# EAGLE design Wireless Temp Sensor Board v1 (EAGLE 6.3)
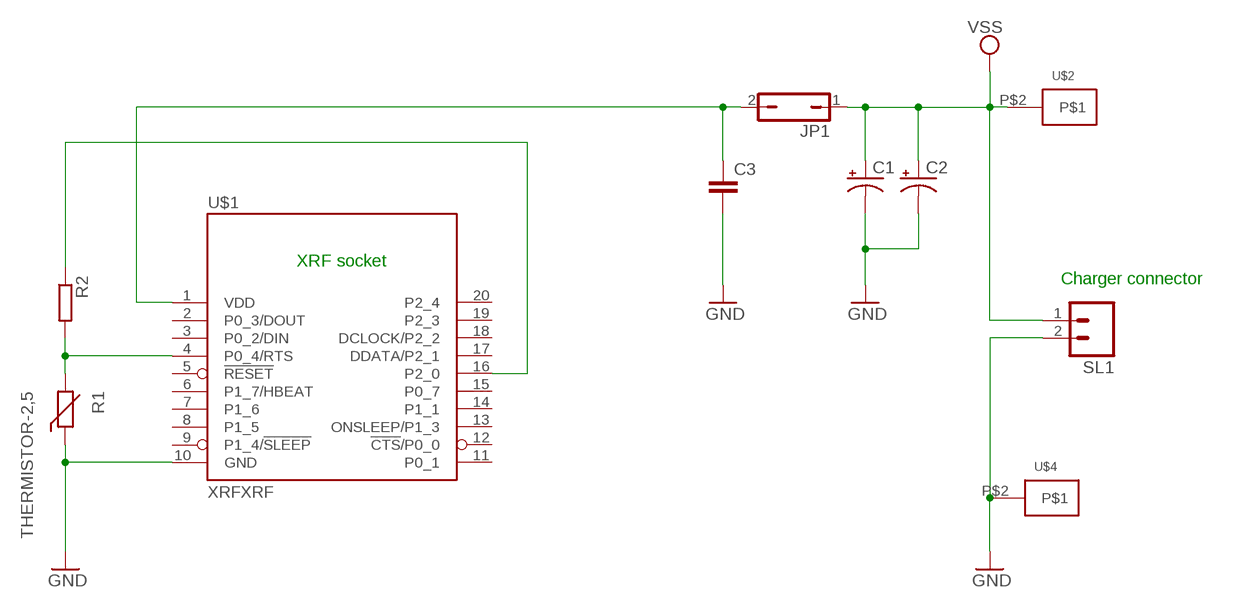
[diagram p0: schematic, sheet 1]

## Parts
C1  CPOL-USE5-10.5  [E5-10,5]
C2  CPOL-USE3.5-8  [E3,5-8]
C3  C-EU025-025X050  [C025-025X050]
JP1  JP1Q  [JP1]
R1  THERMISTOR-2,5  [RS-2,5]
R2  R-EU_0207/12  [0207/12]
SL1  M02  [02P]
U$1  XRFXRF  [XRF]
U$2  HORSESHOEDPAD  [HORSESHOEPAD]
U$4  HORSESHOEDPAD  [HORSESHOEPAD]

## Nets
GND: C1.- C2.- C3.2 R1.1 SL1.2 U$1.10(GND) U$4.P$2
N$1: R2.1 U$1.16(P2_0)
N$3: R1.2 R2.2 U$1.4(P0_4/RTS)
N$5: C3.1 JP1.2 U$1.1(VDD)
VSS: C1.+ C2.+ JP1.1 SL1.1 U$2.P$2
Unconnected: U$1.2(P0_3/DOUT) U$1.3(P0_2/DIN) U$1.5(!RESET) U$1.6(P1_7/HBEAT) U$1.7(P1_6) U$1.8(P1_5) U$1.9(P1_4/!SLEEP) U$1.11(P0_1) U$1.12(!CTS!/P0_0) U$1.13(ONSLEEP/P1_3) U$1.14(P1_1) U$1.15(P0_7) U$1.17(DDATA/P2_1) U$1.18(DCLOCK/P2_2) U$1.19(P2_3) U$1.20(P2_4)

## Notes on the sheet
- XRF socket
- Charger connector

## Library data of the parts
C1 C2 = rcl:CPOL-US: POLARIZED CAPACITOR, American symbol
C3 = rcl:C-EU: CAPACITOR, European symbol
JP1 = jumper:JP1Q: JUMPER
R1 = varistor:THERMISTOR: THERMISTOR
R2 = rcl:R-EU_: RESISTOR, European symbol
SL1 = con-amp-quick:M02: AMP QUICK CONNECTOR; OC_FARNELL: unknown; OC_NEWARK: unknown
U$1 = Ciseco Footprints:XRF: XRF Wireless UART Serial Data Module. www.ciseco.co.uk
U$2 U$4 = horseshoedpad:HORSESHOEDPAD

## Board
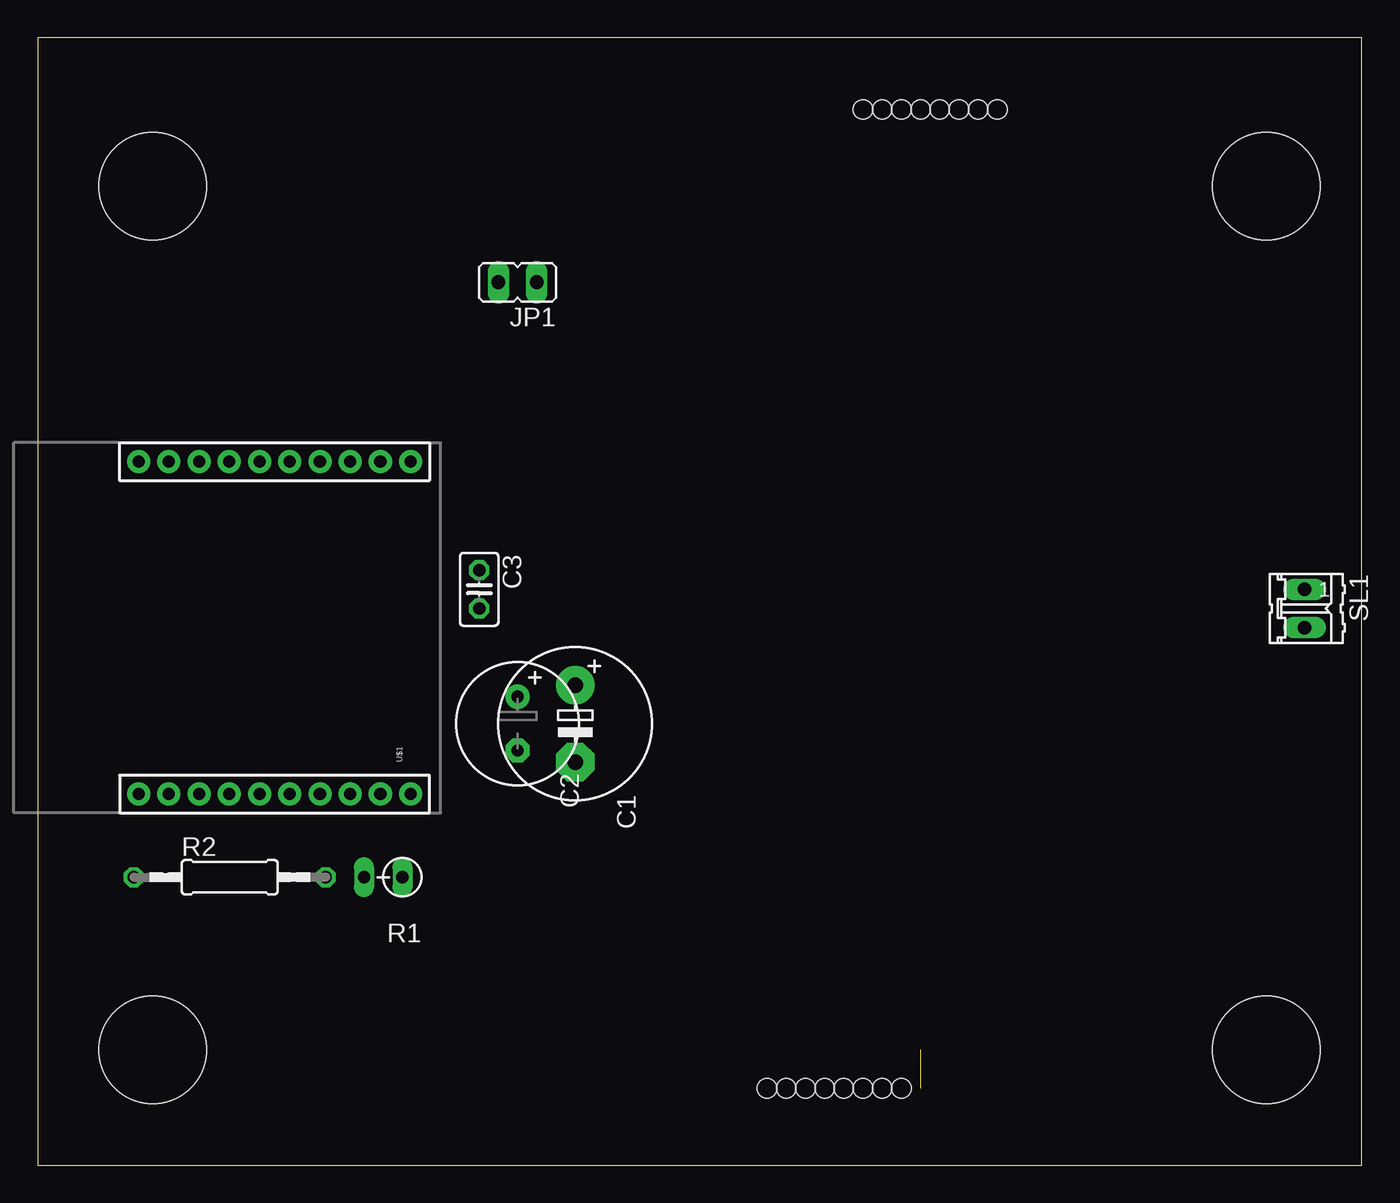
[diagram p1: board, top side]
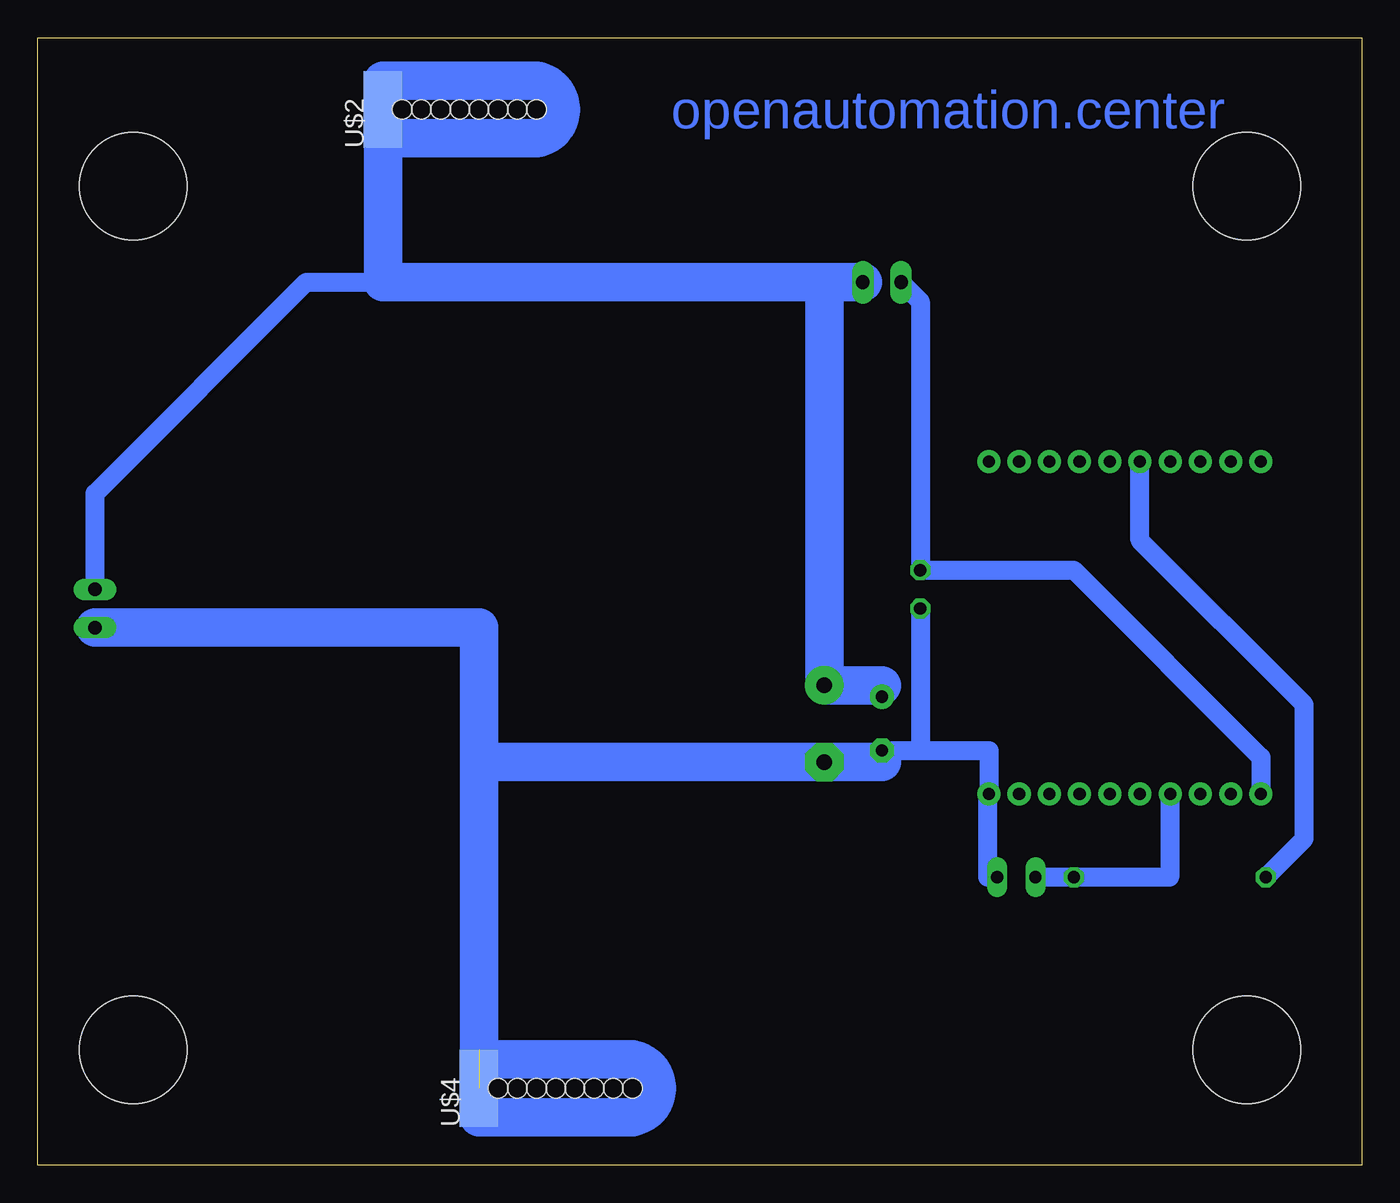
[diagram p2: board, bottom side, seen from below]

Size 87.61 x 74.6 mm. Coordinates in mm from the lower left corner, seen from the top.
Outline: 0,0 87.61,0 87.61,74.6 0,74.6 0,0
Copper layers (1*16): Top 0.035mm / dielectric 1.5mm / Bottom 0.035mm
Design rules "default *": minimum track width 16mil, minimum drill 24mil, track to track 20mil, track to pad 10mil, pad to pad 10mil, via to via 12mil, smd to smd 10mil, copper to edge 40mil, drill to drill 8mil, minimum pad ring 10mil, minimum via ring 8mil, stop-mask expansion 4mil, vias tented up to drill 0mil, thermal gap 20mil
Holes 7.11 mm at 7.62,7.62 81.28,64.77 81.28,7.62 7.62,64.77

### Footprints (pad centres in the part's own frame; a part is rotated, then mirrored left to right if it is on the bottom)
E5-10,5 = drill 1.016 pad 2.54: + -2.54,0 | drill 1.016 pad 2.54 octagon: - 2.54,0
E3,5-8 = drill 0.813 pad 1.6: + -1.778,0 | drill 0.813 pad 1.6 octagon: - 1.778,0
C025-025X050 = drill 0.813 octagon: 1 -1.27,0; 2 1.27,0
JP1 = drill 0.914 long: 1 0,-1.27; 2 0,1.27
RS-2,5 = drill 0.813 long: 1 -1.27,0; 2 1.27,0
0207/12 = drill 0.813 octagon: 1 -6.35,0; 2 6.35,0
02P = drill 0.914 long: 1 -1.27,0; 2 1.27,0
XRF = drill 0.8 pad 1.524: 1 -11,20; 2 -11,18; 3 -11,16; 4 -11,14; 5 -11,12; 6 -11,10; 7 -11,8; 8 -11,6; 9 -11,4; 10 -11,2; 11 11,2; 12 11,4; 13 11,6; 14 11,8; 15 11,10; 16 11,12; 17 11,14; 18 11,16; 19 11,18; 20 11,20
HORSESHOEPAD = smd 5.08 x 2.54: P$2 0,0 | hole 1.27: 0,-2.54; 0,-3.81; 0,-5.08; 0,-6.35; 0,-7.62; 0,-1.27; 0,-8.89; 0,-10.16

### Placement (x,y rotation side)
C1  35.56,29.21 270 top
C2  31.75,29.21 270 top
C3  29.21,38.1 270 top
JP1  31.75,58.42 90 top
R1  22.86,19.05 180 top
R2  12.7,19.05 0 top
SL1  83.82,36.83 270 top
U$1  26.67,35.56 90 top
U$2  64.77,69.85 90 bottom
U$4  58.42,5.08 90 bottom

### Tracks (layer width: path | path; a pad name or v marks a point on that pad's centre or on a via)
GND  (1 unrouted)
  Bottom 0.406: 31.75,26.67 C2.-
  Bottom 1.27: C2.- 29.21,27.43 | 29.21,27.43 24.67,27.43 U$1.10 24.77,24.56 24.77,19.05 R1.1 | C3.2 29.21,27.43
  Bottom 2.54: 31.75,26.67 C1.- 58.42,26.67 | SL1.2 58.42,35.56 58.42,26.67 | 58.42,26.67 58.42,7.62
N$1
  Bottom 1.27: R2.1 3.81,21.59 3.81,30.48 14.67,41.34 U$1.16
N$3
  Bottom 1.27: U$1.4 12.7,24.56 12.7,19.05 R2.2 R1.2
N$5
  Bottom 1.27: JP1.2 29.21,57.15 C3.1 19.05,39.37 6.67,26.99 U$1.1
VSS
  Bottom 0.406: 31.75,31.75 C2.+
  Bottom 1.27: SL1.1 83.82,44.45 69.85,58.42 64.77,58.42
  Bottom 2.54: 31.75,31.75 C1.+ 35.56,58.42 | JP1.1 35.56,58.42 | 35.56,58.42 64.77,58.42 U$2.P$2

### Text on the board
Bottom: openautomation.center